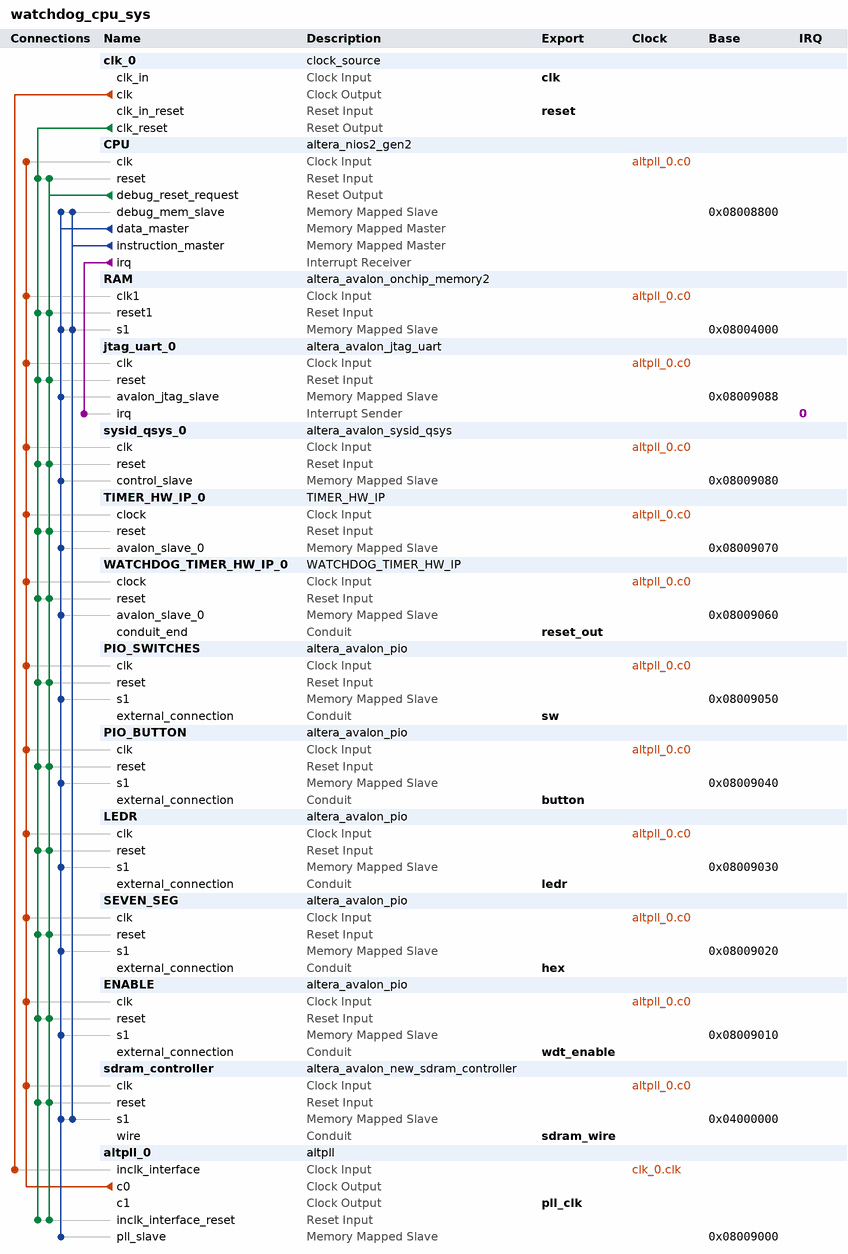
[diagram p0: system contents]
# Platform Designer (Qsys) system watchdog_cpu_sys, MAX 10 10M50DAF484C7G
# Parameters at their usual value, and those the tool derives, are not listed.
package require -exact qsys 18.1
create_system watchdog_cpu_sys
set_project_property DEVICE_FAMILY {MAX 10}
set_project_property DEVICE 10M50DAF484C7G

add_instance clk_0 clock_source 18.1
set_instance_parameter_value clk_0 clockFrequency 50000000

add_instance CPU altera_nios2_gen2 18.1
set_instance_parameter_value CPU dcache_size 2048
set_instance_parameter_value CPU exceptionSlave RAM.s1
set_instance_parameter_value CPU icache_size 4096
set_instance_parameter_value CPU impl Tiny
set_instance_parameter_value CPU resetSlave RAM.s1

add_instance RAM altera_avalon_onchip_memory2 18.1
set_instance_parameter_value RAM dataWidth 32
set_instance_parameter_value RAM dualPort false
set_instance_parameter_value RAM initMemContent false
set_instance_parameter_value RAM initializationFileName onchip_mem.hex
set_instance_parameter_value RAM memorySize 16384

add_instance jtag_uart_0 altera_avalon_jtag_uart 18.1
set_instance_parameter_value jtag_uart_0 simInteractiveOptions NO_INTERACTIVE_WINDOWS

add_instance sysid_qsys_0 altera_avalon_sysid_qsys 18.1
set_instance_parameter_value sysid_qsys_0 id 0

add_instance TIMER_HW_IP_0 TIMER_HW_IP 1.0

add_instance WATCHDOG_TIMER_HW_IP_0 WATCHDOG_TIMER_HW_IP 1.0

add_instance PIO_SWITCHES altera_avalon_pio 18.1
set_instance_parameter_value PIO_SWITCHES direction Input
set_instance_parameter_value PIO_SWITCHES width 8

add_instance PIO_BUTTON altera_avalon_pio 18.1
set_instance_parameter_value PIO_BUTTON direction Input
set_instance_parameter_value PIO_BUTTON width 1

add_instance LEDR altera_avalon_pio 18.1
set_instance_parameter_value LEDR direction Output
set_instance_parameter_value LEDR width 8

add_instance SEVEN_SEG altera_avalon_pio 18.1
set_instance_parameter_value SEVEN_SEG direction Output
set_instance_parameter_value SEVEN_SEG width 7

add_instance ENABLE altera_avalon_pio 18.1
set_instance_parameter_value ENABLE direction Input
set_instance_parameter_value ENABLE width 1

add_instance sdram_controller altera_avalon_new_sdram_controller 18.1
set_instance_parameter_value sdram_controller TAC 5.4
set_instance_parameter_value sdram_controller TRCD 15.0
set_instance_parameter_value sdram_controller TRP 15.0
set_instance_parameter_value sdram_controller casLatency 3
set_instance_parameter_value sdram_controller columnWidth 10
set_instance_parameter_value sdram_controller dataWidth 16
set_instance_parameter_value sdram_controller generateSimulationModel false
set_instance_parameter_value sdram_controller model single_Micron_MT48LC4M32B2_7_chip
set_instance_parameter_value sdram_controller numberOfBanks 4
set_instance_parameter_value sdram_controller numberOfChipSelects 1
set_instance_parameter_value sdram_controller powerUpDelay 100.0
set_instance_parameter_value sdram_controller refreshPeriod 7.8125
set_instance_parameter_value sdram_controller rowWidth 13

add_instance altpll_0 altpll 18.1
set_instance_parameter_value altpll_0 CLK0_DIVIDE_BY 1
set_instance_parameter_value altpll_0 CLK0_MULTIPLY_BY 1
set_instance_parameter_value altpll_0 CLK1_DIVIDE_BY 1
set_instance_parameter_value altpll_0 CLK1_DUTY_CYCLE 50
set_instance_parameter_value altpll_0 CLK1_MULTIPLY_BY 1
set_instance_parameter_value altpll_0 CLK1_PHASE_SHIFT -5000
set_instance_parameter_value altpll_0 INCLK0_INPUT_FREQUENCY 20000
set_instance_parameter_value altpll_0 PORT_ARESET PORT_UNUSED
set_instance_parameter_value altpll_0 PORT_LOCKED PORT_UNUSED
set_instance_parameter_value altpll_0 PORT_clk1 PORT_USED
set_instance_parameter_value altpll_0 PORT_clk2 PORT_UNUSED
set_instance_parameter_value altpll_0 PORT_clk3 PORT_UNUSED

# connections
add_connection altpll_0.c0 CPU.clk clock
add_connection altpll_0.c0 ENABLE.clk clock
add_connection altpll_0.c0 jtag_uart_0.clk clock
add_connection altpll_0.c0 LEDR.clk clock
add_connection altpll_0.c0 PIO_BUTTON.clk clock
add_connection altpll_0.c0 PIO_SWITCHES.clk clock
add_connection altpll_0.c0 RAM.clk1 clock
add_connection altpll_0.c0 sdram_controller.clk clock
add_connection altpll_0.c0 SEVEN_SEG.clk clock
add_connection altpll_0.c0 sysid_qsys_0.clk clock
add_connection altpll_0.c0 TIMER_HW_IP_0.clock clock
add_connection altpll_0.c0 WATCHDOG_TIMER_HW_IP_0.clock clock
add_connection clk_0.clk altpll_0.inclk_interface clock
add_connection clk_0.clk_reset altpll_0.inclk_interface_reset reset
add_connection clk_0.clk_reset CPU.reset reset
add_connection clk_0.clk_reset ENABLE.reset reset
add_connection clk_0.clk_reset jtag_uart_0.reset reset
add_connection clk_0.clk_reset LEDR.reset reset
add_connection clk_0.clk_reset PIO_BUTTON.reset reset
add_connection clk_0.clk_reset PIO_SWITCHES.reset reset
add_connection clk_0.clk_reset RAM.reset1 reset
add_connection clk_0.clk_reset sdram_controller.reset reset
add_connection clk_0.clk_reset SEVEN_SEG.reset reset
add_connection clk_0.clk_reset sysid_qsys_0.reset reset
add_connection clk_0.clk_reset TIMER_HW_IP_0.reset reset
add_connection clk_0.clk_reset WATCHDOG_TIMER_HW_IP_0.reset reset
add_connection CPU.debug_reset_request altpll_0.inclk_interface_reset reset
add_connection CPU.debug_reset_request CPU.reset reset
add_connection CPU.debug_reset_request ENABLE.reset reset
add_connection CPU.debug_reset_request jtag_uart_0.reset reset
add_connection CPU.debug_reset_request LEDR.reset reset
add_connection CPU.debug_reset_request PIO_BUTTON.reset reset
add_connection CPU.debug_reset_request PIO_SWITCHES.reset reset
add_connection CPU.debug_reset_request RAM.reset1 reset
add_connection CPU.debug_reset_request sdram_controller.reset reset
add_connection CPU.debug_reset_request SEVEN_SEG.reset reset
add_connection CPU.debug_reset_request sysid_qsys_0.reset reset
add_connection CPU.debug_reset_request TIMER_HW_IP_0.reset reset
add_connection CPU.debug_reset_request WATCHDOG_TIMER_HW_IP_0.reset reset
add_connection CPU.data_master altpll_0.pll_slave avalon
set_connection_parameter_value CPU.data_master/altpll_0.pll_slave baseAddress 0x08009000
add_connection CPU.data_master CPU.debug_mem_slave avalon
set_connection_parameter_value CPU.data_master/CPU.debug_mem_slave baseAddress 0x08008800
add_connection CPU.data_master ENABLE.s1 avalon
set_connection_parameter_value CPU.data_master/ENABLE.s1 baseAddress 0x08009010
add_connection CPU.data_master jtag_uart_0.avalon_jtag_slave avalon
set_connection_parameter_value CPU.data_master/jtag_uart_0.avalon_jtag_slave baseAddress 0x08009088
add_connection CPU.data_master LEDR.s1 avalon
set_connection_parameter_value CPU.data_master/LEDR.s1 baseAddress 0x08009030
add_connection CPU.data_master PIO_BUTTON.s1 avalon
set_connection_parameter_value CPU.data_master/PIO_BUTTON.s1 baseAddress 0x08009040
add_connection CPU.data_master PIO_SWITCHES.s1 avalon
set_connection_parameter_value CPU.data_master/PIO_SWITCHES.s1 baseAddress 0x08009050
add_connection CPU.data_master RAM.s1 avalon
set_connection_parameter_value CPU.data_master/RAM.s1 baseAddress 0x08004000
add_connection CPU.data_master sdram_controller.s1 avalon
set_connection_parameter_value CPU.data_master/sdram_controller.s1 baseAddress 0x04000000
add_connection CPU.data_master SEVEN_SEG.s1 avalon
set_connection_parameter_value CPU.data_master/SEVEN_SEG.s1 baseAddress 0x08009020
add_connection CPU.data_master sysid_qsys_0.control_slave avalon
set_connection_parameter_value CPU.data_master/sysid_qsys_0.control_slave baseAddress 0x08009080
add_connection CPU.data_master TIMER_HW_IP_0.avalon_slave_0 avalon
set_connection_parameter_value CPU.data_master/TIMER_HW_IP_0.avalon_slave_0 baseAddress 0x08009070
add_connection CPU.data_master WATCHDOG_TIMER_HW_IP_0.avalon_slave_0 avalon
set_connection_parameter_value CPU.data_master/WATCHDOG_TIMER_HW_IP_0.avalon_slave_0 baseAddress 0x08009060
add_connection CPU.instruction_master CPU.debug_mem_slave avalon
set_connection_parameter_value CPU.instruction_master/CPU.debug_mem_slave baseAddress 0x08008800
add_connection CPU.instruction_master RAM.s1 avalon
set_connection_parameter_value CPU.instruction_master/RAM.s1 baseAddress 0x08004000
add_connection CPU.instruction_master sdram_controller.s1 avalon
set_connection_parameter_value CPU.instruction_master/sdram_controller.s1 baseAddress 0x04000000
add_connection CPU.irq jtag_uart_0.irq interrupt
set_connection_parameter_value CPU.irq/jtag_uart_0.irq irqNumber 0

# exported interfaces
add_interface button conduit end
set_interface_property button EXPORT_OF PIO_BUTTON.external_connection
add_interface clk clock sink
set_interface_property clk EXPORT_OF clk_0.clk_in
add_interface hex conduit end
set_interface_property hex EXPORT_OF SEVEN_SEG.external_connection
add_interface ledr conduit end
set_interface_property ledr EXPORT_OF LEDR.external_connection
add_interface pll_clk clock source
set_interface_property pll_clk EXPORT_OF altpll_0.c1
add_interface reset reset sink
set_interface_property reset EXPORT_OF clk_0.clk_in_reset
add_interface reset_out conduit end
set_interface_property reset_out EXPORT_OF WATCHDOG_TIMER_HW_IP_0.conduit_end
add_interface sdram_wire conduit end
set_interface_property sdram_wire EXPORT_OF sdram_controller.wire
add_interface sw conduit end
set_interface_property sw EXPORT_OF PIO_SWITCHES.external_connection
add_interface wdt_enable conduit end
set_interface_property wdt_enable EXPORT_OF ENABLE.external_connection

set_interconnect_requirement {$system} qsys_mm.clockCrossingAdapter HANDSHAKE
set_interconnect_requirement {$system} qsys_mm.enableEccProtection FALSE
set_interconnect_requirement {$system} qsys_mm.insertDefaultSlave FALSE
set_interconnect_requirement {$system} qsys_mm.maxAdditionalLatency 1

save_system watchdog_cpu_sys.qsys
